# EAGLE design Sch (EAGLE 9.6.1)
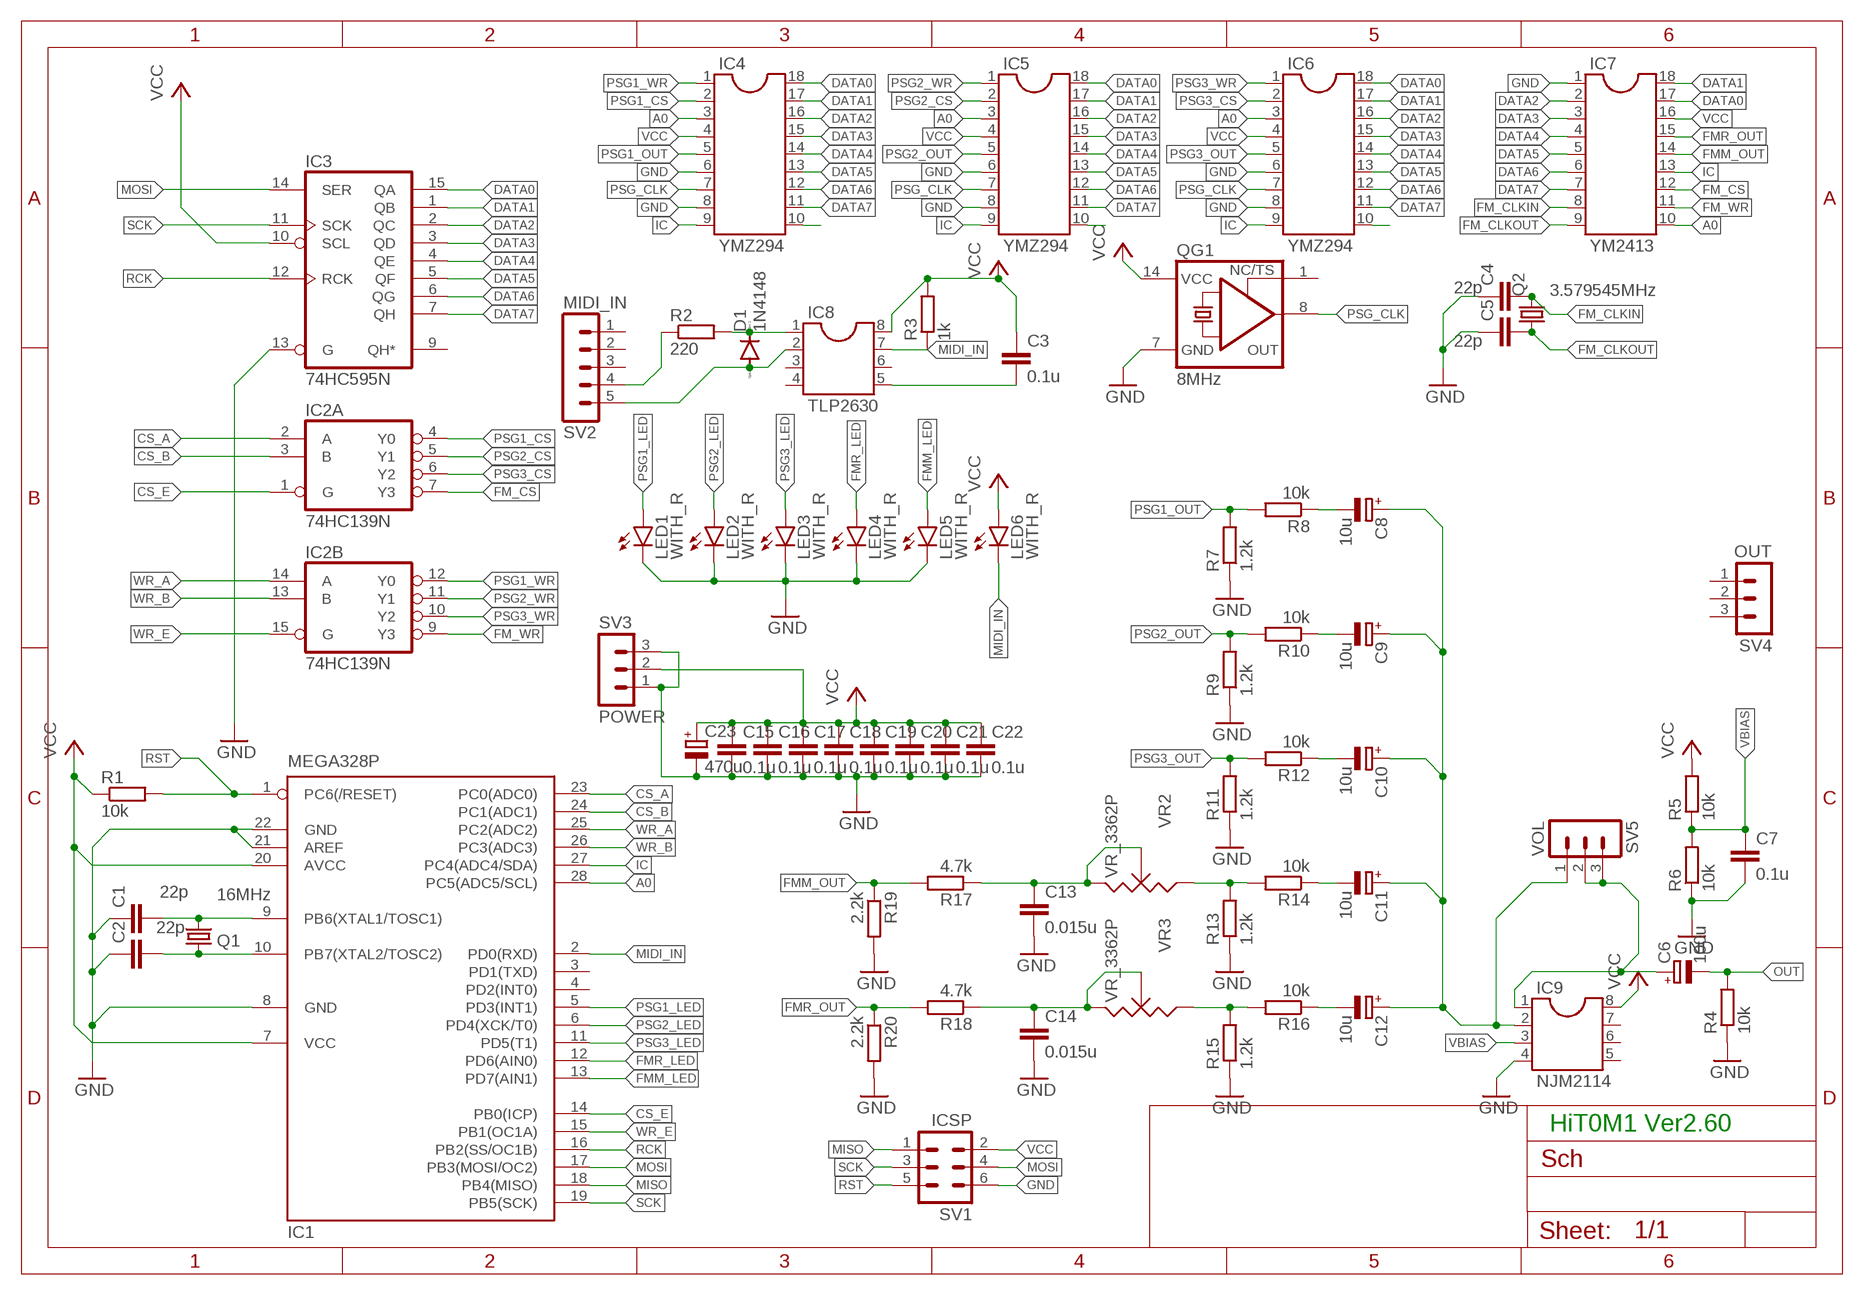
[diagram p0: schematic, sheet 1]

## Parts
C1  22p  C-EU025-025X050  [C025-025X050]
C2  22p  C-EU025-025X050  [C025-025X050]
C3  0.1u  C-EU025-025X050  [C025-025X050]
C4  22p  C-EU025-025X050  [C025-025X050]
C5  22p  C-EU025-025X050  [C025-025X050]
C6  100u  CPOL-EUE2.5-6  [E2,5-6]
C7  0.1u  C-EU025-025X050  [C025-025X050]
C8  10u  CPOL-EUE2.5-6  [E2,5-6]
C9  10u  CPOL-EUE2.5-6  [E2,5-6]
C10  10u  CPOL-EUE2.5-6  [E2,5-6]
C11  10u  CPOL-EUE2.5-6  [E2,5-6]
C12  10u  CPOL-EUE2.5-6  [E2,5-6]
C13  0.015u  C-EU050-025X075  [C050-025X075]
C14  0.015u  C-EU050-025X075  [C050-025X075]
C15  0.1u  C-EU025-025X050  [C025-025X050]
C16  0.1u  C-EU025-025X050  [C025-025X050]
C17  0.1u  C-EU025-025X050  [C025-025X050]
C18  0.1u  C-EU025-025X050  [C025-025X050]
C19  0.1u  C-EU025-025X050  [C025-025X050]
C20  0.1u  C-EU025-025X050  [C025-025X050]
C21  0.1u  C-EU025-025X050  [C025-025X050]
C22  0.1u  C-EU025-025X050  [C025-025X050]
C23  470u  CPOL-EUE2.5-6  [E2,5-6]
D1  1N4148  1N4148DO35-7  [DO35-7]
IC1  MEGA328P  MEGA8-P  [DIL28-3]
IC2  74HC139N  [DIL16]
IC3  74HC595N  [DIL16]
IC4  YMZ294  DIL18S  [SOCKET-18]
IC5  YMZ294  DIL18S  [SOCKET-18]
IC6  YMZ294  DIL18S  [SOCKET-18]
IC7  YM2413  DIL18S  [SOCKET-18]
IC8  TLP2630  DIL8S  [SOCKET-08]
IC9  NJM2114  DIL8S  [SOCKET-08]
LED1  WITH_R  LED3MM  [LED3MM]
LED2  WITH_R  LED3MM  [LED3MM]
LED3  WITH_R  LED3MM  [LED3MM]
LED4  WITH_R  LED3MM  [LED3MM]
LED5  WITH_R  LED3MM  [LED3MM]
LED6  WITH_R  LED3MM  [LED3MM]
Q1  16MHz  CRYSTALHC49S  [HC49/S]
Q2  3.579545MHz  CRYSTALHC49S  [HC49/S]
QG1  8MHz  XO-14  [DIL14S]
R1  10k  R-EU_0207/10  [0207/10]
R2  220  R-EU_0207/10  [0207/10]
R3  1k  R-EU_0207/10  [0207/10]
R4  10k  R-EU_0207/10  [0207/10]
R5  10k  R-EU_0207/10  [0207/10]
R6  10k  R-EU_0207/10  [0207/10]
R7  1.2k  R-EU_0207/2V  [0207/2V]
R8  10k  R-EU_0207/2V  [0207/2V]
R9  1.2k  R-EU_0207/2V  [0207/2V]
R10  10k  R-EU_0207/2V  [0207/2V]
R11  1.2k  R-EU_0207/2V  [0207/2V]
R12  10k  R-EU_0207/2V  [0207/2V]
R13  1.2k  R-EU_0207/2V  [0207/2V]
R14  10k  R-EU_0207/2V  [0207/2V]
R15  1.2k  R-EU_0207/2V  [0207/2V]
R16  10k  R-EU_0207/2V  [0207/2V]
R17  4.7k  R-EU_0207/2V  [0207/2V]
R18  4.7k  R-EU_0207/2V  [0207/2V]
R19  2.2k  R-EU_0207/2V  [0207/2V]
R20  2.2k  R-EU_0207/2V  [0207/2V]
SV1  ICSP  MA03-2  [MA03-2]
SV2  MIDI_IN  MA05-1  [MA05-1]
SV3  POWER  MA03-1  [MA03-1]
SV4  OUT  MA03-1  [MA03-1]
SV5  VOL  MA03-1  [MA03-1]
VR2  VR_3362P  P-03277_VR_3362P  [VR_3362P]
VR3  VR_3362P  P-03277_VR_3362P  [VR_3362P]

## Nets
A0 [SIGNAL]: IC1.28(PC5(ADC5/SCL)) IC4.3 IC5.3 IC6.3 IC7.10
CS_A [SIGNAL]: IC1.23(PC0(ADC0)) IC2.2(A:A)
CS_B [SIGNAL]: IC1.24(PC1(ADC1)) IC2.3(A:B)
CS_E: IC1.14(PB0(ICP)) IC2.1(A:G)
DATA0 [SIGNAL]: IC3.15(QA) IC4.18 IC5.18 IC6.18 IC7.17
DATA1 [SIGNAL]: IC3.1(QB) IC4.17 IC5.17 IC6.17 IC7.18
DATA2 [SIGNAL]: IC3.2(QC) IC4.16 IC5.16 IC6.16 IC7.2
DATA3 [SIGNAL]: IC3.3(QD) IC4.15 IC5.15 IC6.15 IC7.3
DATA4 [SIGNAL]: IC3.4(QE) IC4.14 IC5.14 IC6.14 IC7.4
DATA5 [SIGNAL]: IC3.5(QF) IC4.13 IC5.13 IC6.13 IC7.5
DATA6 [SIGNAL]: IC3.6(QG) IC4.12 IC5.12 IC6.12 IC7.6
DATA7 [SIGNAL]: IC3.7(QH) IC4.11 IC5.11 IC6.11 IC7.7
FM_CLKIN: C4.2 IC7.8 Q2.2
FM_CLKOUT: C5.2 IC7.9 Q2.1
FM_CS [SIGNAL]: IC2.7(A:Y3) IC7.12
FM_WR [SIGNAL]: IC2.9(B:Y3) IC7.11
FMM_LED [SIGNAL]: IC1.13(PD7(AIN1)) LED5.A
FMM_OUT: IC7.14 R17.2 R19.1
FMR_LED [SIGNAL]: IC1.12(PD6(AIN0)) LED4.A
FMR_OUT: IC7.15 R18.2 R20.1
GND [POWERLINE]: C1.1 C2.1 C4.1 C5.1 C7.2 C13.2 C14.2 C15.2 C16.2 C17.2 C18.2 C19.2 C20.2 C21.2 C22.2 C23.- IC1.8(GND) IC1.21(AREF) IC1.22(GND) IC3.13(G) IC4.6 IC4.8 IC5.6 IC5.8 IC6.6 IC6.8 IC7.1 IC9.4 LED1.K(C) LED2.K(C) LED3.K(C) LED4.K(C) LED5.K(C) QG1.7(GND) R4.1 R6.1 R7.1 R9.1 R11.1 R13.1 R15.1 R19.2 R20.2 SV1.6 SV3.1 SV3.3
IC [SIGNAL]: IC1.27(PC4(ADC4/SDA)) IC4.9 IC5.9 IC6.9 IC7.13
MIDI_IN: IC1.2(PD0(RXD)) IC8.7 LED6.K(C) R3.1
MISO [SIGNAL]: IC1.18(PB4(MISO)) SV1.1
MOSI [SIGNAL]: IC1.17(PB3(MOSI/OC2)) IC3.14(SER) SV1.4
N$1: C1.2 IC1.9(PB6(XTAL1/TOSC1)) Q1.2
N$2: R2.1 SV2.4
N$3: D1.C IC8.1 R2.2
N$4: D1.A IC8.2 SV2.5
N$5: C3.2 IC8.5
N$7: C6.+ IC9.1 SV5.2 SV5.3
N$8: IC5.10
N$10: C8.- R8.1
N$11: IC4.10
N$13: IC6.10
N$14: C2.2 IC1.10(PB7(XTAL2/TOSC2)) Q1.1
N$15: C9.- R10.1
N$17: C10.- R12.1
N$18: R13.2 R14.2 VR2.1
N$19: C11.- R14.1
N$20: R15.2 R16.2 VR3.1
N$21: C12.- R16.1
N$22: C14.1 R18.1 VR3.2 VR3.3
N$23: C8.+ C9.+ C10.+ C11.+ C12.+ IC9.2 SV5.1
N$24: C13.1 R17.1 VR2.2 VR2.3
OUT: C6.- R4.2
PSG1_CS [SIGNAL]: IC2.4(A:Y0) IC4.2
PSG1_LED [SIGNAL]: IC1.5(PD3(INT1)) LED1.A
PSG1_OUT: IC4.5 R7.2 R8.2
PSG1_WR [SIGNAL]: IC2.12(B:Y0) IC4.1
PSG2_CS [SIGNAL]: IC2.5(A:Y1) IC5.2
PSG2_LED [SIGNAL]: IC1.6(PD4(XCK/T0)) LED2.A
PSG2_OUT: IC5.5 R9.2 R10.2
PSG2_WR [SIGNAL]: IC2.11(B:Y1) IC5.1
PSG3_CS [SIGNAL]: IC2.6(A:Y2) IC6.2
PSG3_LED [SIGNAL]: IC1.11(PD5(T1)) LED3.A
PSG3_OUT: IC6.5 R11.2 R12.2
PSG3_WR [SIGNAL]: IC2.10(B:Y2) IC6.1
PSG_CLK [SIGNAL]: IC4.7 IC5.7 IC6.7 QG1.8(OUT)
RCK [SIGNAL]: IC1.16(PB2(SS/OC1B)) IC3.12(RCK)
RST [SIGNAL]: IC1.1(PC6(/RESET)) R1.2 SV1.5
SCK [SIGNAL]: IC1.19(PB5(SCK)) IC3.11(SCK) SV1.3
VBIAS [SIGNAL]: C7.1 IC9.3 R5.1 R6.2
VCC [POWERLINE]: C3.1 C15.1 C16.1 C17.1 C18.1 C19.1 C20.1 C21.1 C22.1 C23.+ IC1.7(VCC) IC1.20(AVCC) IC3.10(SCL) IC4.4 IC5.4 IC6.4 IC7.16 IC8.8 IC9.8 LED6.A QG1.14(VCC) R1.1 R3.2 R5.2 SV1.2 SV3.2
WR_A [SIGNAL]: IC1.25(PC2(ADC2)) IC2.14(B:A)
WR_B [SIGNAL]: IC1.26(PC3(ADC3)) IC2.13(B:B)
WR_E: IC1.15(PB1(OC1A)) IC2.15(B:G)
Unconnected: IC1.3(PD1(TXD)) IC1.4(PD2(INT0)) IC3.9(QH*) IC8.3 IC8.4 IC8.6 IC9.5 IC9.6 IC9.7 QG1.1(TS) SV2.1 SV2.2 SV2.3 SV4.1 SV4.2 SV4.3

## Notes on the sheet
- HiT0M1 Ver2.60

## Power pins joined to a net without a drawn wire
GND: IC2.8(P:GND) IC3.8(GND)
VCC: IC2.16(P:VCC) IC3.16(VCC)

## Library data of the parts
C1-C5 C7 C13-C22 = rcl:C-EU: CAPACITOR, European symbol; SPICEPREFIX: C
C6 C8-C12 C23 = rcl:CPOL-EU: POLARIZED CAPACITOR, European symbol; SPICEPREFIX: C
D1 = diode:1N4148: DIODE high speed (Philips)
IC1 = atmel:MEGA8-P: MICROCONTROLLER 8 Kbytes FLASH, 1 kbytes SRAM, 512 bytes EEPROM, USART, 4-channel 10 bit ADC, 2-channel 8 bit ADC Pin compatible with Atmega48, ATMega88, ATMega168 Source: avr.lbr; OC_FARNELL: unknown; OC_NEWARK: unknown
IC2 = 74xx-eu:74*139: Dual 2-line to 4-line DECODER/DEMULTIPLEXER
IC3 = 74xx-eu:74*595: 8-bit SHIFT REGISTER, output latch
IC4-IC7 = ic-package:DIL18: Dual In Line / Socket
IC8 IC9 = ic-package:DIL8: Dual In Line / Socket
LED1-LED6 = led:LED: LED OSRAM: - CHIPLED LG R971, LG N971, LY N971, LG Q971, LY Q971, LO R971, LY R971 LH N974, LH R974 LS Q976, LO Q976, LY Q976 LO Q996 - Hyper CHIPLED LW Q18S LB Q993, LB Q99A, LB R99A - SideLED LS A670, LO A670, LY A670, LG A670, LP A670 LB A673, LV A673, LT A673, LW A673 LH A674 LY A675 LS A676, LA A676, LO A676, LY A676, LW A676 LS A679, LY A679, LG A679 - Hyper Micro SIDELED® LS Y876, LA Y876, LO Y876, LY Y876 LT Y87S - SmartLED LW L88C, LW L88S LB L89C, LB L89S, LG L890 LS L89K, LO L89K, LY L89K LS L896, LA L896, LO L896, LY L896 - TOPLED LS T670, LO T670, LY T670, LG T670, LP T670 LSG T670, LSP T670, LSY T670, LOP T670, LYG T670 LG T671, LOG T671, LSG T671 LB T673, LV T673, LT T673, LW T673 LH T674 LS T676, LA T676, LO T676, LY T676, LB T676, LH T676, LSB T676, LW T676 LB T67C, LV T67C, LT T67C, LS T67K, LO T67K, LY T67K, LW E67C LS E67B, LA E67B, LO E67B, LY E67B, LB E67C, LV E67C, LT E67C LW T67C LS T679, LY T679, LG T679 LS T770, LO T770, LY T770, LG T770, LP T770 LB T773, LV T773, LT T773, LW T773 LH T774 LS E675, LA E675, LY E675, LS T675 LS T776, LA T776, LO T776, LY T776, LB T776 LHGB T686 LT T68C, LB T68C - Hyper Mini TOPLED® LB M676 - Mini TOPLED Santana® LG M470 LS M47K, LO M47K, LY M47K Source: http://www.osram.convergy.de LUXEON: - LUMILED® LXK2-PW12-R00, LXK2-PW12-S00, LXK2-PW14-U00, LXK2-PW14-V00 LXK2-PM12-R00, LXK2-PM12-S00, LXK2-PM14-U00 LXK2-PE12-Q00, LXK2-PE12-R00, LXK2-PE12-S00, LXK2-PE14-T00, LXK2-PE14-U00 LXK2-PB12-K00, LXK2-PB12-L00, LXK2-PB12-M00, LXK2-PB14-N00, LXK2-PB14-P00, LXK2-PB14-Q00 LXK2-PR12-L00, LXK2-PR12-M00, LXK2-PR14-Q00, LXK2-PR14-R00 LXK2-PD12-Q00, LXK2-PD12-R00, LXK2-PD12-S00 LXK2-PH12-R00, LXK2-PH12-S00 LXK2-PL12-P00, LXK2-PL12-Q00, LXK2-PL12-R00 Source: www.luxeon.com KINGBRIGHT: KA-3528ASYC Source: www.kingbright.com
Q1 Q2 = crystal:CRYSTAL: CRYSTAL; OC_FARNELL: 1667008; OC_NEWARK: unknown
QG1 = crystal:XO-: CRYSTAL; OC_FARNELL: unknown; OC_NEWARK: unknown
R1-R20 = rcl:R-EU_: RESISTOR, European symbol; SPICEPREFIX: R
SV1 = con-lstb:MA03-2: PIN HEADER; OC_FARNELL: unknown; OC_NEWARK: unknown
SV2 = con-lstb:MA05-1: PIN HEADER; OC_FARNELL: unknown; OC_NEWARK: unknown
SV3-SV5 = con-lstb:MA03-1: PIN HEADER; OC_FARNELL: unknown; OC_NEWARK: unknown
VR2 VR3 = Akizuki:P-03277_VR_3362P

## Net classes
0 other: width 0.635 mm, clearance 0.33 mm
1 POWERLINE: width 0.889 mm, clearance 0.33 mm
2 SIGNAL: width 0.508 mm, clearance 0.254 mm

## Board
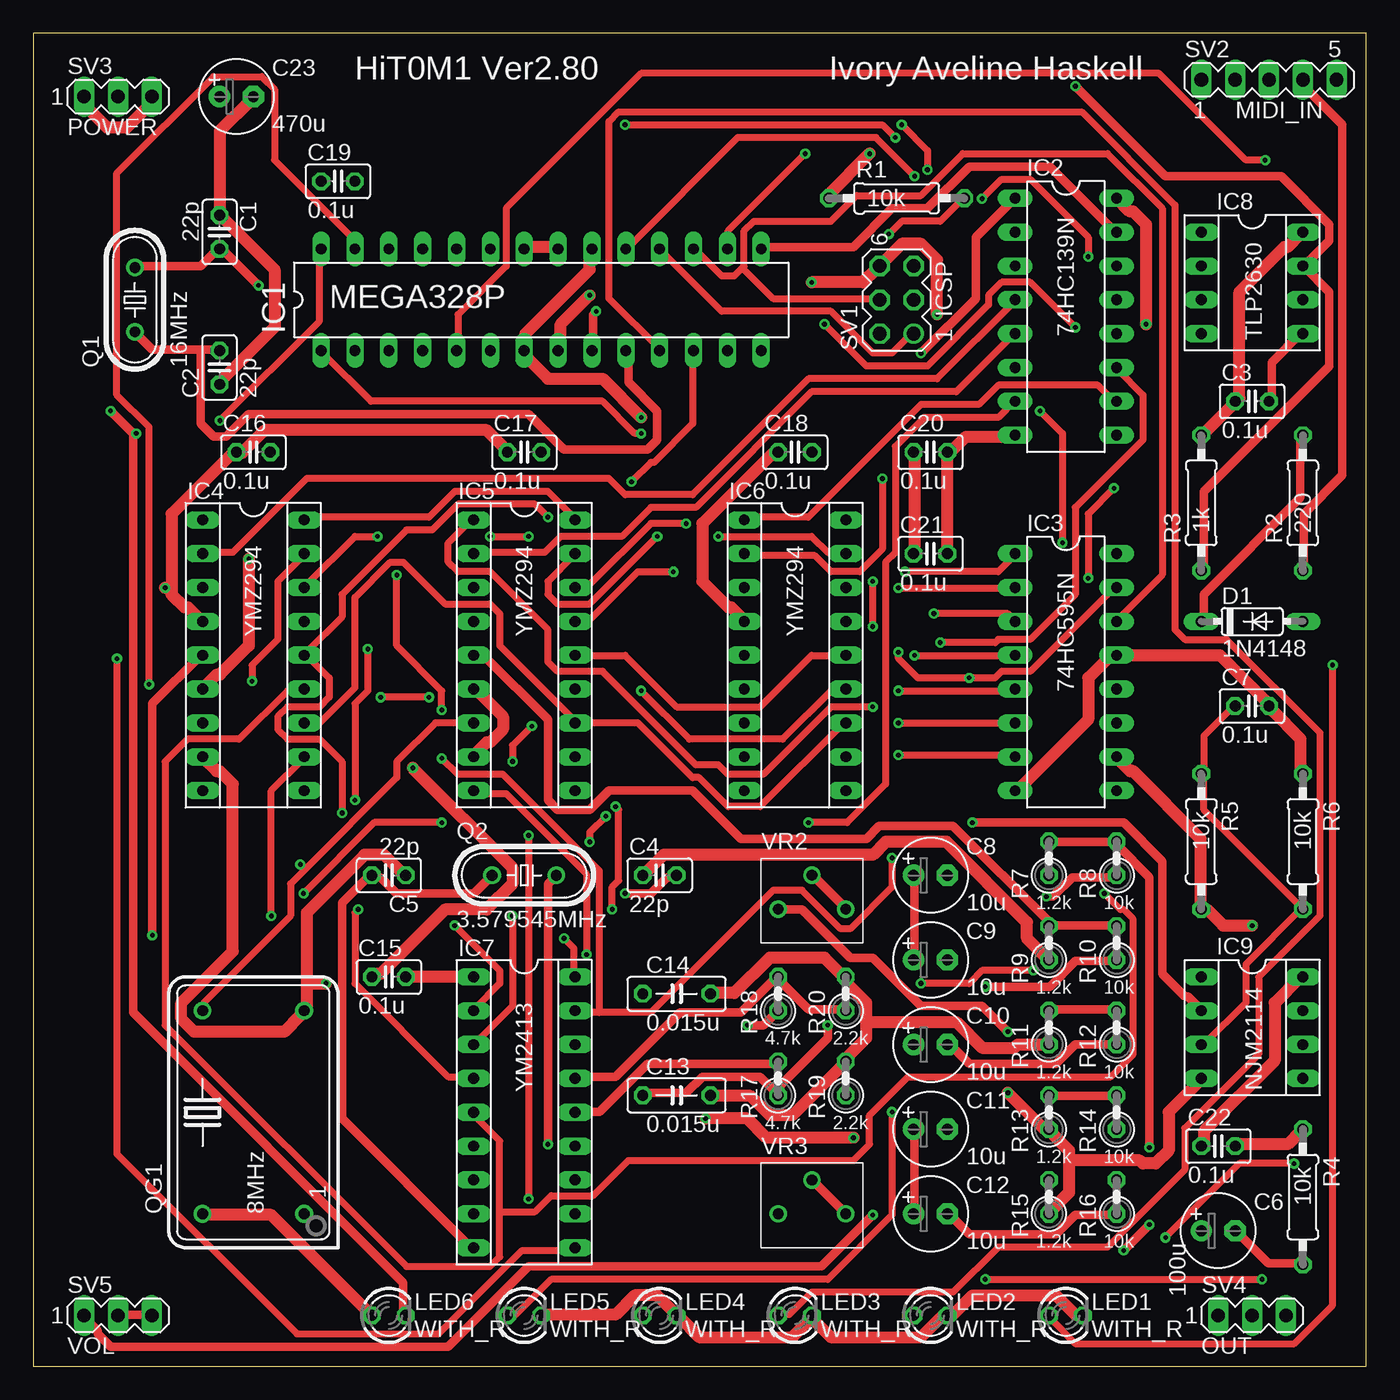
[diagram p1: board, top side]
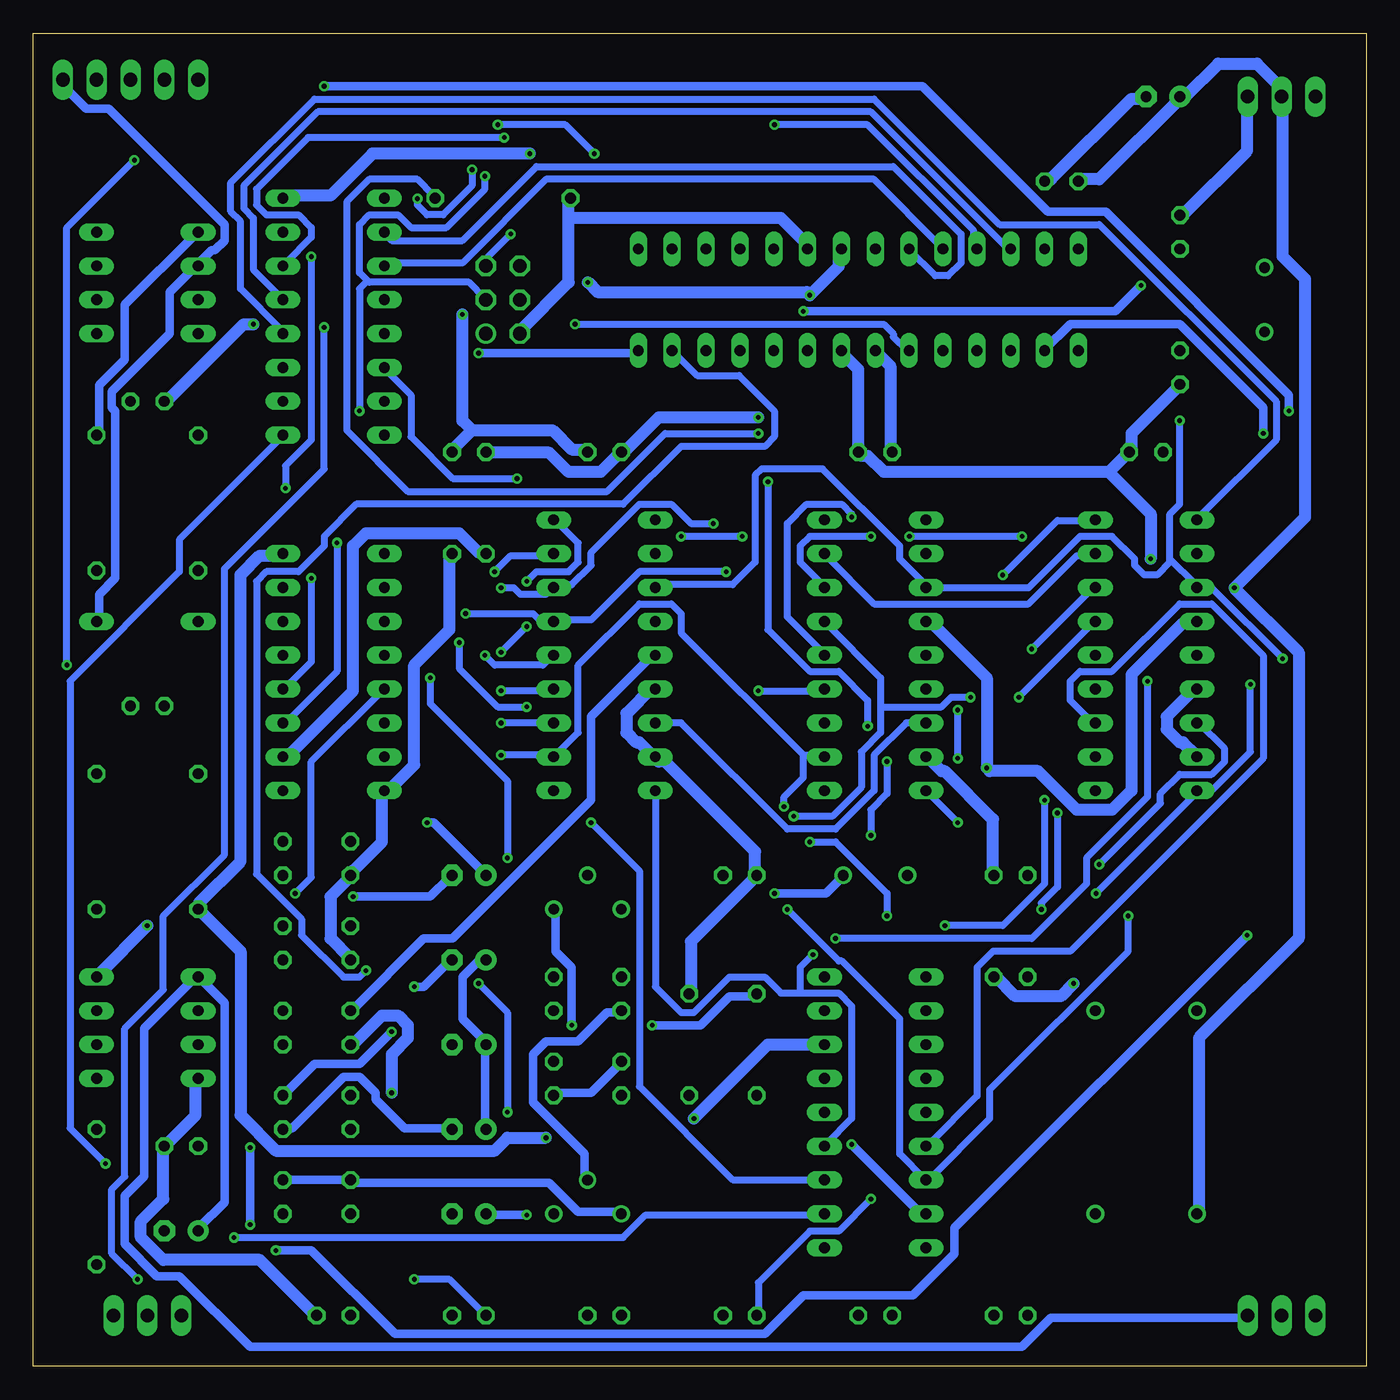
[diagram p2: board, bottom side, seen from below]

Size 100 x 100 mm. Coordinates in mm from the lower left corner, seen from the top.
Outline: 0,0 100,0 100,100 0,100 0,0
Copper layers (1*16): Top 0.035mm / dielectric 1.5mm / Bottom 0.035mm
Design rules "default": minimum track width 6mil, minimum drill 0.35mm, track to track 6mil, track to pad 6mil, pad to pad 6mil, via to via 6mil, smd to smd 6mil, copper to edge 40mil, drill to drill 6mil, minimum pad ring 10mil, minimum via ring 8mil, stop-mask expansion 4mil, vias tented up to drill 0mil, thermal gap 10mil

### Footprints (pad centres in the part's own frame; a part is rotated, then mirrored left to right if it is on the bottom)
C025-025X050 = drill 0.813 octagon: 1 -1.27,0; 2 1.27,0
E2,5-6 = drill 0.813 pad 1.6: + -1.27,0 | drill 0.813 pad 1.6 octagon: - 1.27,0
C050-025X075 = drill 0.813 octagon: 1 -2.54,0; 2 2.54,0
DO35-7 = drill 0.813 long: A 3.81,0; C -3.81,0
DIL28-3 = drill 0.813 long: 1 -16.51,-3.81; 2 -13.97,-3.81; 3 -11.43,-3.81; 4 -8.89,-3.81; 5 -6.35,-3.81; 6 -3.81,-3.81; 7 -1.27,-3.81; 8 1.27,-3.81; 9 3.81,-3.81; 10 6.35,-3.81; 11 8.89,-3.81; 12 11.43,-3.81; 13 13.97,-3.81; 14 16.51,-3.81; 15 16.51,3.81; 16 13.97,3.81; 17 11.43,3.81; 18 8.89,3.81; 19 6.35,3.81; 20 3.81,3.81; 21 1.27,3.81; 22 -1.27,3.81; 23 -3.81,3.81; 24 -6.35,3.81; 25 -8.89,3.81; 26 -11.43,3.81; 27 -13.97,3.81; 28 -16.51,3.81
DIL16 = drill 0.813 long: 1 -8.89,-3.81; 2 -6.35,-3.81; 3 -3.81,-3.81; 4 -1.27,-3.81; 5 1.27,-3.81; 6 3.81,-3.81; 7 6.35,-3.81; 8 8.89,-3.81; 9 8.89,3.81; 10 6.35,3.81; 11 3.81,3.81; 12 1.27,3.81; 13 -1.27,3.81; 14 -3.81,3.81; 15 -6.35,3.81; 16 -8.89,3.81
SOCKET-18 = drill 0.813 long: 1 -10.16,-3.81; 2 -7.62,-3.81; 3 -5.08,-3.81; 4 -2.54,-3.81; 5 0,-3.81; 6 2.54,-3.81; 7 5.08,-3.81; 8 7.62,-3.81; 9 10.16,-3.81; 10 10.16,3.81; 11 7.62,3.81; 12 5.08,3.81; 13 2.54,3.81; 14 0,3.81; 15 -2.54,3.81; 16 -5.08,3.81; 17 -7.62,3.81; 18 -10.16,3.81
SOCKET-08 = drill 0.813 long: 1 -3.81,-3.81; 2 -1.27,-3.81; 3 1.27,-3.81; 4 3.81,-3.81; 5 3.81,3.81; 6 1.27,3.81; 7 -1.27,3.81; 8 -3.81,3.81
LED3MM = drill 0.813 octagon: A -1.27,0; K 1.27,0
HC49/S = drill 0.813: 1 -2.413,0; 2 2.413,0
DIL14S = drill 0.813: 1 -7.62,-3.81; 7 7.62,-3.81; 8 7.62,3.81; 14 -7.62,3.81
0207/10 = drill 0.813 octagon: 1 -5.08,0; 2 5.08,0
0207/2V = drill 0.813 octagon: 1 -1.27,0; 2 1.27,0
MA03-2 = drill 1.016: 1 -2.54,-1.27 | drill 1.016 octagon: 2 -2.54,1.27; 3 0,-1.27; 4 0,1.27; 5 2.54,-1.27; 6 2.54,1.27
MA05-1 = drill 1.016 long: 1 -5.08,0; 2 -2.54,0; 3 0,0; 4 2.54,0; 5 5.08,0
MA03-1 = drill 1.016 long: 1 -2.54,0; 2 0,0; 3 2.54,0
VR_3362P = drill 0.8: 1 0,0; 2 2.54,2.54; 3 5.08,0

### Placement (x,y rotation side)
C1  13.97,85.09 270 top
C2  13.97,74.93 90 top
C3  91.44,72.39 0 top
C4  46.99,36.83 0 top
C5  26.67,36.83 180 top
C6  88.9,10.16 0 top
C7  91.44,49.53 0 top
C8  67.31,36.83 0 top
C9  67.31,30.48 0 top
C10  67.31,24.13 0 top
C11  67.31,17.78 0 top
C12  67.31,11.43 0 top
C13  48.26,20.32 0 top
C14  48.26,27.94 0 top
C15  26.67,29.21 0 top
C16  16.51,68.58 0 top
C17  36.83,68.58 0 top
C18  57.15,68.58 0 top
C19  22.86,88.9 0 top
C20  67.31,68.58 0 top
C21  67.31,60.96 0 top
C22  88.9,16.51 0 top
C23  15.24,95.25 0 top
D1  91.44,55.88 0 top
IC1  38.1,80.01 0 top
IC2  77.47,78.74 270 top
IC3  77.47,52.07 270 top
IC4  16.51,53.34 270 top
IC5  36.83,53.34 270 top
IC6  57.15,53.34 270 top
IC7  36.83,19.05 270 top
IC8  91.44,81.28 270 top
IC9  91.44,25.4 270 top
LED1  77.47,3.81 0 top
LED2  67.31,3.81 0 top
LED3  57.15,3.81 0 top
LED4  46.99,3.81 0 top
LED5  36.83,3.81 0 top
LED6  26.67,3.81 0 top
Q1  7.62,80.01 90 top
Q2  36.83,36.83 0 top
QG1  16.51,19.05 90 top
R1  64.77,87.63 0 top
R2  95.25,64.77 90 top
R3  87.63,64.77 90 top
R4  95.25,12.7 270 top
R5  87.63,39.37 270 top
R6  95.25,39.37 270 top
R7  76.2,38.1 90 top
R8  81.28,38.1 90 top
R9  76.2,31.75 90 top
R10  81.28,31.75 90 top
R11  76.2,25.4 90 top
R12  81.28,25.4 90 top
R13  76.2,19.05 90 top
R14  81.28,19.05 90 top
R15  76.2,12.7 90 top
R16  81.28,12.7 90 top
R17  55.88,21.59 90 top
R18  55.88,27.94 90 top
R19  60.96,21.59 90 top
R20  60.96,27.94 90 top
SV1  64.77,80.01 90 top
SV2  92.71,96.52 0 top
SV3  6.35,95.25 0 top
SV4  91.44,3.81 0 top
SV5  6.35,3.81 0 top
VR2  55.88,34.29 0 top
VR3  55.88,11.43 0 top

### Tracks (layer width: path | path; a pad name or v marks a point on that pad's centre or on a via)
A0  (via drill 0.35)
  Top 0.508: v6.27,53.09 6.27,15.93 19.79,2.41 30.4,2.41 36.68,8.69 40.54,8.69 IC7.10 | v13.99,70.94 21.48,78.42 21.48,83.73 IC1.28
  Bottom 0.508: v6.27,53.09 11.58,58.4 12.55,58.4 IC4.3 12.79,58.64 14.72,60.57 | v13.99,70.94 13.99,64.67 14.72,63.94 14.72,60.57 | 14.72,60.57 14.72,60.33 15.68,59.36 16.65,59.36 17.37,60.08 17.37,60.57 19.06,62.26 21.48,62.26 25.34,58.4 32.82,58.4 IC5.3 33.06,58.64 34.99,60.57 34.99,61.53 40.78,67.32 45.36,67.32 45.85,66.84 45.85,60.33 47.54,58.64 53.33,58.64 IC6.3
CS_A
  Bottom 0.508: IC1.23 34.27,83.73 32.33,81.8 31.37,81.8 30.4,82.77 30.4,84.94 35.47,90 62.26,90 67.81,84.45 73.11,84.45 73.6,84.94 IC2.2
CS_B
  Bottom 0.508: IC2.3 73.6,82.77 67.81,82.77 61.53,89.04 36.92,89.04 31.85,83.97 IC1.24
CS_E  (via drill 0.35)
  Top 0.635: v66.6,76.01 70.7,80.11 70.7,84.7 73.6,87.59 IC2.1
  Bottom 0.635: v66.6,76.01 54.77,76.01 IC1.14
DATA0  (via drill 0.35)
  Top 0.508: IC4.18 20.51,63.7 29.68,63.7 31.61,65.63 38.61,65.63 40.54,63.7 IC5.18 | 42.47,26.54 46.33,26.54 55.5,35.71 57.67,35.71 60.57,32.82 61.29,32.82 64.43,35.95 v64.43,38.12 | 42.47,26.54 40.78,26.54 IC7.17 | IC3.15 81.08,58.4 74.8,52.12 72.63,52.12 72.15,51.64 v70.22,51.64 66.36,51.64 64.91,53.09 v64.91,53.57 | v62.98,55.5 v62.98,58.88 | v27.27,59.36 27.27,54.05 30.64,50.67 v30.64,49.23 | v30.64,45.61 31.85,44.4 35.23,44.4 42.47,37.16 42.47,26.54
  Bottom 0.508: v64.43,38.12 64.43,43.92 70.22,49.71 v70.22,51.64 | v62.98,58.88 62.26,59.6 59.84,59.6 59.12,60.33 59.12,61.77 60.81,63.46 IC6.18 | v64.91,53.57 v62.98,55.5 | v27.27,59.36 23.16,63.46 20.51,63.46 IC4.18 | v30.64,45.61 v30.64,49.23
DATA1  (via drill 0.35)
  Top 0.508: v65.39,59.6 72.39,59.6 73.6,60.81 IC3.1 | v39.81,32.09 40.54,31.37 40.54,29.44 IC7.18 | v16.41,51.4 16.41,52.6 18.34,54.53 18.34,58.88 20.27,60.81 IC4.17 | v51.4,62.26 58.4,62.26 59.6,61.05 60.81,61.05 IC6.17 | v46.81,62.26 41.74,57.19 39.33,57.19 38.61,57.91 38.61,58.88 40.54,60.81 IC5.17
  Bottom 0.508: v65.39,59.6 64.19,60.81 61.05,60.81 IC6.17 | IC4.17 20.51,60.81 21.72,60.81 25.34,57.19 36.92,57.19 40.54,60.81 IC5.17 | v39.81,32.09 25.09,32.09 20.99,36.2 20.99,38.12 16.41,42.71 v16.41,51.4 | v46.81,62.26 v51.4,62.26
DATA2  (via drill 0.35)
  Top 0.508: v48.98,63.22 46.33,63.22 41.74,58.64 40.78,58.64 IC5.16 | v64.91,58.4 73.6,58.4 IC3.2 | v31.61,33.06 34.99,29.68 34.99,28.71 33.06,26.78 IC7.2 | v24.13,42.47 24.13,49.71 25.09,50.67 v25.09,53.81 | v34.27,62.26 v37.16,62.26 | v25.82,62.26 24.13,62.26 20.51,58.64 IC4.16
  Bottom 0.508: v48.98,63.22 50.67,63.22 52.12,64.67 54.53,64.67 58.15,61.05 58.15,60.08 59.6,58.64 60.81,58.64 IC6.16 61.05,58.4 61.53,57.91 63.46,57.91 63.94,58.4 v64.91,58.4 | v31.61,33.06 27.27,33.06 24.13,36.2 v24.13,42.47 | v25.09,53.81 20.51,58.4 IC4.16 | v37.16,62.26 41.74,62.26 42.47,61.53 42.47,60.33 40.78,58.64 IC5.16 | v25.82,62.26 v34.27,62.26
DATA3  (via drill 0.35)
  Top 0.508: v67.56,56.46 73.11,56.46 73.6,55.98 IC3.3 | v35.95,33.78 35.95,27.03 33.06,24.13 IC7.3 | v41.74,39.33 41.74,40.06 v42.95,41.26 | v29.68,50.19 v26.06,50.19 | v48.02,59.6 45.36,59.6 41.74,55.98 40.78,55.98 IC5.15
  Bottom 0.508: v67.56,56.46 62.5,56.46 62.01,55.98 61.05,55.98 IC6.15 60.81,55.98 58.15,55.98 54.53,59.6 v48.02,59.6 | v35.95,33.78 35.95,35.47 39.81,39.33 v41.74,39.33 | v42.95,41.26 40.06,41.26 37.88,43.43 37.88,46.09 36.44,47.54 36.44,49.47 | 36.44,49.47 36.44,51.64 40.54,55.74 IC5.15 | v26.06,50.19 20.51,55.74 IC4.15 | v29.68,50.19 31.13,50.19 31.85,49.47 36.44,49.47
DATA4  (via drill 0.35)
  Top 0.508: v38.61,63.7 37.64,64.67 31.85,64.67 29.92,62.74 27.99,62.74 23.16,57.91 23.16,56.22 20.51,53.57 IC4.14 20.51,53.33 22.2,51.64 22.2,50.19 21.48,49.47 19.06,49.47 18.34,48.74 18.34,47.78 19.06,47.05 21.48,47.05 23.16,45.36 v23.16,41.5 | v24.37,34.27 24.13,34.02 24.13,28.71 31.13,21.72 32.82,21.72 IC7.4 | IC6.14 60.81,53.33 58.4,53.33 54.53,49.47 48.26,49.47 44.4,53.33 40.78,53.33 IC5.14 | v66.12,53.33 73.6,53.33 IC3.4
  Bottom 0.508: v38.61,63.7 38.61,63.94 39.33,64.67 41.99,64.67 43.43,63.22 43.43,56.22 40.78,53.57 IC5.14 | v24.37,34.27 24.37,34.75 23.16,35.95 v23.16,41.5 | v66.12,53.33 65.39,52.6 61.77,52.6 61.05,53.33 IC6.14
DATA5  (via drill 0.35)
  Top 0.508: v45.61,50.67 49.23,47.05 56.22,47.05 59.84,50.67 60.81,50.67 IC6.13 | v64.91,50.67 73.6,50.67 IC3.5 | 34.99,11.58 34.99,8.2 34.27,7.48 27.99,7.48 9.89,25.58 9.89,45.36 11.58,47.05 15.44,47.05 19.06,50.67 20.27,50.67 IC4.13 | 34.99,11.58 34.99,16.89 33.06,18.82 IC7.5 | v80.35,35.47 81.56,34.27 81.8,34.27 82.53,33.54 82.53,23.41 80.83,21.72 65.63,21.72 62.74,18.82 62.74,16.65 61.53,15.44 44.64,15.44 41.99,12.79 38.85,12.79 37.64,11.58 34.99,11.58
  Bottom 0.508: v45.61,50.67 40.78,50.67 IC5.13 | v64.91,50.67 61.05,50.67 IC6.13 | v80.35,35.47 79.15,36.68 79.15,45.36 73.84,50.67 IC3.5
DATA6  (via drill 0.35)
  Top 0.508: IC6.12 60.81,48.26 54.53,41.99 52.12,41.99 49.95,44.16 49.47,44.16 45.36,48.26 IC5.12 40.54,48.5 34.99,54.05 34.99,56.46 34.27,57.19 30.89,57.19 27.75,60.33 26.78,60.33 24.13,57.67 24.13,50.91 21.48,48.26 IC4.12 | v64.91,48.26 IC3.6
  Bottom 0.508: IC6.12 v64.91,48.26 | IC7.6 32.82,16.65 29.2,20.27 29.2,29.92 27.99,31.13 22.2,31.13 7.72,45.61 7.72,53.33 11.58,57.19 13.99,57.19 19.06,52.12 21.48,52.12 22.2,51.4 22.2,49.95 20.51,48.26 IC4.12
DATA7  (via drill 0.35)
  Top 0.508: v64.91,45.85 73.6,45.85 IC3.7 | v17.86,33.78 17.86,43.19 20.27,45.61 IC4.11 | v43.67,41.99 43.92,41.74 43.92,36.44 43.43,35.95 v43.43,34.27
  Bottom 0.508: 42.23,45.85 40.78,45.85 IC5.11 | 42.23,45.85 51.4,55.02 51.4,56.46 52.12,57.19 54.53,57.19 59.12,52.6 59.12,47.54 60.81,45.85 IC6.11 61.05,45.85 v64.91,45.85 | v17.86,33.78 17.86,31.13 28.23,20.75 28.23,18.58 32.82,13.99 IC7.7 33.06,13.99 34.99,15.93 34.99,26.06 39.33,30.4 39.57,30.4 v43.43,34.27 | 42.23,45.85 42.23,44.16 43.67,42.71 v43.67,41.99
FM_CLKIN  (via drill 0.35)
  Top 0.635: v38.61,16.65 38.61,36.2 Q2.2 | v44.4,35.47 46.33,35.47 47.54,36.68 48.26,36.68 C4.2
  Bottom 0.635: v38.61,16.65 33.54,11.58 33.06,11.58 IC7.8 | v44.4,35.47 40.54,35.47 39.33,36.68 Q2.2
FM_CLKOUT
  Top 0.635: Q2.1 33.06,35.47 27.27,35.47 26.06,36.68 25.58,36.68 C5.2 25.09,36.68 23.16,34.75 23.16,18.58 32.82,8.93 IC7.9
FM_CS  (via drill 0.35)
  Top 0.508: v58.15,40.78 61.05,40.78 63.94,43.67 63.94,60.33 64.67,61.05 64.67,69.01 66.84,71.18 72.39,71.18 73.6,72.39 IC2.7
  Bottom 0.508: v58.15,40.78 54.53,37.16 54.53,20.99 47.54,13.99 40.78,13.99 IC7.12
FM_WR  (via drill 0.35)
  Top 0.508: v84.94,9.65 90.49,15.2 v94.59,15.2
  Bottom 0.508: v84.94,9.65 55.74,9.65 54.05,11.34 40.78,11.34 IC7.11 | v94.59,15.2 97.24,17.86 97.24,51.4 89.04,59.6 89.04,62.01 81.32,69.74 IC2.9
FMM_LED  (via drill 0.35)
  Top 0.508: v64.43,19.06 64.43,11.34 59.6,6.51 38.85,6.51 36.2,3.86 35.71,3.86 LED5.A | v66.6,28.71 70.22,28.71 71.18,29.68 v75.04,29.68
  Bottom 0.508: v64.43,19.06 64.43,26.54 v66.6,28.71 | v75.04,29.68 75.53,29.2 76.73,29.2 79.87,32.33 79.87,33.54 83.25,36.92 83.25,58.88 82.53,59.6 80.11,59.6 78.18,61.53 78.18,62.26 75.77,64.67 55.74,64.67 51.4,69.01 45.12,69.01 44.4,69.74 44.4,71.67 47.05,74.32 50.19,74.32 IC1.13
FMM_OUT
  Top 0.635: IC7.14 40.78,19.06 42.47,19.06 46.09,22.68 55.74,22.68 R17.2
  Bottom 0.635: R19.1 60.81,20.51 58.15,20.51 55.98,22.68 R17.2
FMR_LED  (via drill 0.35)
  Top 0.508: v37.16,39.81 v37.16,12.55 | v35.95,45.36 35.95,46.57 v37.4,48.02 | v44.88,66.36 46.33,67.81 46.57,67.81 49.47,70.7 49.47,76.01 IC1.12
  Bottom 0.508: v37.16,12.55 39.57,10.13 41.74,10.13 45.61,6.27 45.61,3.86 LED4.A | v37.16,39.81 37.16,41.74 35.95,42.95 v35.95,45.36 | v37.4,48.02 37.4,49.95 39.57,52.12 41.74,52.12 44.88,55.26 v44.88,66.36
FMR_OUT
  Top 0.635: IC7.15 40.78,21.72 43.67,21.72 48.5,26.54 53.09,26.54 55.74,29.2 R18.2 55.98,28.96 58.15,26.78 60.81,26.78 R20.1
GND  (via drill 0.35)
  Top 0.889: IC5.8 33.06,45.85 34.02,46.81 34.27,46.81 35.23,47.78 35.23,48.74 33.06,50.91 IC5.6 | C15.2 27.99,29.2 32.82,29.2 IC7.1 | 20.51,28.71 20.51,34.02 24.85,38.37 26.3,38.37 27.75,36.92 C5.1 | 20.51,28.71 20.51,26.78 QG1.7 20.03,26.3 18.82,25.09 12.06,25.09 11.1,26.06 11.1,27.27 14.96,31.13 14.96,43.67 13.99,44.64 13.75,44.64 12.79,45.61 IC4.8 | 20.51,28.71 v21.96,28.71 | IC1.22 36.92,83.97 39.33,83.97 IC1.21 | v41.74,80.35 39.57,78.18 39.57,76.25 IC1.8 | SV3.1 3.86,95.07 3.86,94.59 5.55,92.9 7,92.9 8.69,94.59 8.69,95.07 SV3.3 | C23.- 16.41,95.07 13.99,92.66 13.99,86.39 C1.1 14.24,86.14 18.1,82.28 18.1,77.94 13.99,73.84 C2.1 | v16.17,60.57 16.17,54.05 13.99,51.88 13.75,51.88 12.79,50.91 IC4.6 | 77.7,15.44 77.7,16.17 76.25,17.61 R13.1 75.77,17.86 v73.11,20.51 | 77.7,15.44 77.7,13.03 76.25,11.58 R15.1 | C22.2 90.25,16.65 94.11,16.65 95.07,17.61 R4.1 | 77.7,15.44 83.01,15.44 83.25,15.2 84.21,15.2 85.18,16.17 85.18,19.06 87.59,21.48 IC9.4 | LED5.K 38.12,3.86 43.67,3.86 45.12,5.31 46.81,5.31 48.26,3.86 LED4.K 48.5,3.62 49.95,2.17 56.95,2.17 58.4,3.62 LED3.K 58.64,3.38 59.84,2.17 66.6,2.17 68.05,3.62 68.53,3.62 LED2.K 69.01,3.86 70.46,5.31 76.73,5.31 78.18,3.86 78.66,3.86 LED1.K | C13.2 50.91,20.27 53.81,20.27 55.26,18.82 56.95,18.82 60.81,22.68 R19.2 61.05,23.16 62.5,24.61 62.5,25.82 | 62.5,25.82 62.5,27.27 61.05,28.71 61.05,29.2 R20.2 60.57,29.44 59.36,30.64 55.26,30.64 52.6,27.99 50.91,27.99 C14.2 | R11.1 73.84,24.13 73.6,23.89 71.18,23.89 69.25,25.82 62.5,25.82 | C21.2 68.53,61.05 68.53,68.53 C20.2 69.01,68.77 69.98,69.74 73.6,69.74 IC2.8
  Top 0.889: v67.81,78.91 67.81,83.01 66.6,84.21 65.15,84.21 63.7,82.77 SV1.6 63.22,82.28 62.26,81.32 v58.4,81.32 | R6.1 95.07,44.64 95.07,47.05 92.9,49.23 C7.2 92.66,49.71 89.04,53.33 81.32,53.33 IC3.13 80.83,53.33 79.15,51.64 79.15,48.5 73.84,43.19 IC3.8 | C4.1 45.85,36.92 47.3,38.37 62.98,38.37 63.94,39.33 68.53,39.33 74.56,33.3 74.56,32.09 76.01,30.64 R9.1
  Bottom 0.889: IC4.8 12.79,45.85 13.75,46.81 13.99,46.81 14.96,47.78 14.96,48.74 12.79,50.91 IC4.6 | v21.96,28.71 22.92,27.75 26.3,27.75 27.75,29.2 C15.2 | IC5.8 32.82,45.61 31.85,44.64 31.61,44.64 27.99,41.02 27.99,36.92 C5.1 | IC1.8 39.33,76.01 38.12,74.8 38.12,68.77 C17.2 37.88,68.29 37.4,68.29 36.2,67.08 19.3,67.08 | IC1.21 39.57,83.73 39.57,82.53 v41.74,80.35 41.99,80.59 57.67,80.59 v58.4,81.32 | C2.1 13.99,73.6 17.61,69.98 17.61,68.77 C16.2 18.1,68.29 19.3,67.08 | C19.2 24.13,89.04 23.65,89.04 17.61,95.07 16.65,95.07 C23.- | SV3.3 8.93,95.07 8.93,91.21 13.75,86.39 C1.1 | v16.17,60.57 16.17,63.94 19.3,67.08 | IC9.4 87.83,21.48 87.83,18.82 90,16.65 C22.2 90.25,16.17 90.25,12.55 91.94,10.86 91.94,9.65 90.25,7.96 83.01,7.96 78.91,3.86 LED1.K | IC6.6 53.57,50.91 55.5,48.98 55.5,47.54 54.77,46.81 54.53,46.81 53.57,45.85 IC6.8 53.09,45.36 52.6,45.36 45.85,38.61 45.85,37.16 C4.1 45.85,36.68 50.67,31.85 50.67,27.99 C14.2 | 67.08,70.22 61.05,70.22 59.6,68.77 58.64,68.77 C18.2 | 67.08,70.22 68.53,68.77 C20.2 | v67.81,78.91 67.81,70.94 67.08,70.22 | R9.1 76.25,30.64 77.7,32.09 77.7,35.23 76.25,36.68 R7.1 76.01,37.16 73.84,39.33 73.84,42.95 IC3.8 73.36,43.19 71.42,45.12 71.42,52.6 68.77,55.26 68.77,60.81 C21.2 | v73.11,20.51 73.11,23.41 71.91,24.61 71.91,25.58 72.63,26.3 73.84,26.3 76.01,24.13 R11.1
IC  (via drill 0.35)
  Top 0.508: v20.27,35.47 25.58,40.78 v30.64,40.78 | IC1.27 24.13,84.45 18.1,90.49 18.1,95.8 17.13,96.76 13.51,96.76 6.27,89.52 6.27,72.87 8.69,70.46 v8.69,51.16 | v41.5,30.89 41.5,36.92 35.47,42.95 33.06,42.95 IC5.9
  Bottom 0.508: 42.47,27.99 43.92,27.99 45.12,29.2 47.78,29.2 50.43,26.54 51.4,26.54 53.33,28.47 53.33,42.95 IC6.9 | 42.47,27.99 39.57,27.99 38.61,27.03 38.61,18.58 40.54,16.65 IC7.13 | v20.27,35.47 12.79,42.95 IC4.9 12.55,43.19 11.58,43.19 8.69,46.09 v8.69,51.16 | v30.64,40.78 32.82,42.95 IC5.9 | 42.47,27.99 42.47,29.92 v41.5,30.89
MIDI_IN  (via drill 0.35)
  Top 0.635: R3.1 87.83,59.84 87.83,65.63 97.24,75.04 97.24,80.59 95.31,82.53 IC8.7 95.56,82.77 97.24,84.45 97.24,85.66 93.62,89.28 84.94,89.28 v78.18,96.04 | LED6.K 27.75,3.86 27.75,6.27 7.48,26.54 7.48,69.74 v7.72,69.98 7.48,69.98 v5.79,71.67
  Bottom 0.635: v7.72,69.98 7.72,71.91 13.99,78.18 22.2,78.18 24.13,76.25 IC1.2 | v78.18,96.04 33.3,96.04 23.89,86.63 19.55,86.63 5.79,72.87 v5.79,71.67
MISO
  Top 0.508: IC1.18 47.05,83.73 51.64,79.15 59.84,79.15 62.98,76.01 64.43,76.01 65.88,77.46 SV1.1
MOSI
  Top 0.508: 53.33,82.53 53.33,85.18 54.05,85.9 59.84,85.9 61.77,87.83 66.6,87.83 69.74,90.97 80.59,90.97 84.7,86.87 84.7,59.36 81.32,55.98 IC3.14 | 53.33,82.53 52.6,81.8 51.64,81.8 49.71,83.73 IC1.17 | SV1.4 63.46,80.11 55.5,80.11 53.33,82.28 53.33,82.53
N$1  (via drill 0.35)
  Top 0.635: Q1.2 7.72,82.53 12.55,82.53 13.75,83.73 C1.2 14.24,83.73 v16.89,81.08 | v42.23,79.15 41.99,78.91 41.99,76.25 IC1.9
  Bottom 0.635: v42.23,79.15 18.82,79.15 v16.89,81.08
N$2
  Top 0.635: R2.1 95.31,59.84 95.31,63.94 98.21,66.84 98.21,93.14 95.31,96.04 95.31,96.52 SV2.4
N$3
  Top 0.635: D1.C 87.83,55.98 87.83,57.91 95.07,65.15 95.07,69.74 R2.2
  Bottom 0.635: IC8.1 87.83,84.94 93.14,79.63 93.14,75.53 95.07,73.6 95.07,69.98 R2.2
N$4
  Bottom 0.635: SV2.5 97.73,96.52 97.73,96.04 96.04,94.35 94.35,94.35 85.66,85.66 85.66,84.45 86.39,83.73 86.63,83.73 87.59,82.77 IC8.2 87.83,82.53 89.76,80.59 89.76,77.46 94.11,73.11 94.11,71.91 93.87,71.67 93.87,59.12 95.07,57.91 95.07,55.98 D1.A
N$5
  Top 0.635: C3.2 92.9,72.39 92.9,75.29 95.07,77.46 IC8.5
N$7
  Top 0.635: SV5.2 6.51,3.86 8.69,3.86 SV5.3
  Bottom 0.635: C6.+ 87.59,10.38 85.66,12.31 85.66,27.27 87.59,29.2 IC9.1 87.83,29.2 91.69,25.34 91.69,14.24 93.14,12.79 93.14,9.17 90.73,6.76 89.04,6.76 83.73,1.45 25.82,1.45 23.65,3.62 8.93,3.62 SV5.3
N$10  (via drill 0.35)
  Top 0.635: v76.01,35.23 76.49,35.23 77.94,36.68 81.08,36.68 R8.1
  Bottom 0.635: v76.01,35.23 70.22,35.23 68.77,36.68 C8.-
N$14
  Top 0.635: 12.55,76.25 8.93,76.25 7.72,77.46 Q1.1 | 12.55,76.25 13.75,76.25 C2.2 | 12.55,76.25 12.55,70.7 13.51,69.74 14.48,69.74 16.17,71.42 37.16,71.42 39.81,68.77 46.09,68.77 46.81,69.49 46.81,71.67 44.64,73.84 44.64,76.01 IC1.10
N$15  (via drill 0.35)
  Top 0.635: v71.42,28.47 76.25,28.47 78.18,30.4 81.08,30.4 R10.1
  Bottom 0.635: v71.42,28.47 70.7,28.47 68.77,30.4 C9.-
N$17
  Top 0.635: R12.1 78.18,24.13 76.73,22.68 70.22,22.68 68.77,24.13 C10.-
N$18  (via drill 0.35)
  Top 0.635: v73.11,25.09 71.18,27.03 66.6,27.03 62.98,30.64 61.29,30.64 57.67,34.27 55.98,34.27 VR2.1 | R13.2 76.25,20.27 81.08,20.27 R14.2
  Bottom 0.635: v73.11,25.09 75.53,22.68 78.91,22.68 81.08,20.51 R14.2
N$19
  Bottom 0.635: R14.1 81.08,17.86 80.59,17.86 76.73,21.72 75.53,21.72 74.32,20.51 74.32,20.03 72.15,17.86 68.77,17.86 C11.-
N$20
  Bottom 0.635: VR3.1 55.98,11.58 59.12,11.58 61.29,13.75 76.01,13.75 R15.2 76.49,13.99 81.08,13.99 R16.2
N$21
  Top 0.635: R16.1 81.08,11.34 78.18,11.34 76.73,9.89 70.22,9.89 68.77,11.34 C12.-
N$22  (via drill 0.35)
  Top 0.635: VR3.2 VR3.3 | v53.57,25.58 54.77,25.58 55.74,26.54 R18.1
  Bottom 0.635: R18.1 55.98,26.54 56.95,26.54 59.12,24.37 61.53,24.37 62.5,23.41 62.5,19.79 58.64,15.93 58.64,13.99 VR3.2 | v53.57,25.58 49.95,25.58 47.78,27.75 45.85,27.75 C14.1
N$23  (via drill 0.35)
  Top 0.635: v70.46,40.78 81.8,40.78 84.7,37.88 84.7,29.44 86.39,27.75 86.63,27.75 87.59,26.78 IC9.2 | C9.+ 66.12,30.64 66.12,36.68 C8.+ | v62.98,11.34 59.12,7.48 37.16,7.48 31.13,1.45 5.79,1.45 4.83,2.41 4.83,2.65 3.86,3.62 SV5.1 | C11.+ 66.12,17.61 66.12,11.58 C12.+
  Bottom 0.635: v70.46,40.78 69.98,40.78 66.12,36.92 C8.+ | v62.98,11.34 65.88,11.34 C12.+ | C11.+ 66.12,17.86 66.12,24.13 C10.+ 66.12,24.37 67.81,26.06 67.81,29.2 66.6,30.4 66.12,30.4 C9.+
N$24  (via drill 0.35)
  Top 0.635: VR2.2 58.64,36.68 60.81,34.51 VR2.3 | C13.1 45.85,20.51 48.98,20.51 50.19,21.72 54.53,21.72 55.74,20.51 R17.1 55.74,20.75 59.6,24.61 v59.6,25.58
  Bottom 0.635: v59.6,25.58 59.6,29.92 60.81,31.13 60.81,34.27 VR2.3
OUT
  Top 0.635: R4.2 95.07,7.72 92.66,7.72 90.25,10.13 C6.-
PSG1_CS
  Top 0.508: IC4.2 12.79,61.05 14.96,61.05 20.51,66.6 43.19,66.6 44.4,65.39 49.47,65.39 58.15,74.08 67.81,74.08 73.6,79.87 IC2.4
PSG1_LED  (via drill 0.35)
  Top 0.508: v92.42,90.49 90.97,90.49 84.45,97 45.61,97 35.47,86.87 35.47,82.53 31.85,78.91 31.85,76.25 IC1.5 | v97.48,52.6 97.48,4.58 94.59,1.69 78.18,1.69 76.25,3.62 LED1.A
  Bottom 0.508: v92.42,90.49 97.48,85.42 v97.48,52.6
PSG1_OUT  (via drill 0.35)
  Top 0.635: R7.2 76.25,39.33 81.08,39.33 R8.2 81.32,39.09 83.73,36.68 v83.73,16.41 | v8.93,32.33 8.93,49.71 12.55,53.33 IC4.5 | v83.73,10.62 v81.8,8.69
  Bottom 0.635: v8.93,32.33 30.89,10.38 30.89,8.45 34.02,5.31 42.23,5.31 45.12,2.41 72.87,2.41 79.15,8.69 v81.8,8.69 | v83.73,16.41 v83.73,10.62
PSG1_WR
  Bottom 0.508: IC4.1 12.55,63.7 6.76,69.49 6.76,72.39 20.03,85.66 27.51,85.66 36.92,95.07 78.91,95.07 85.18,88.8 85.18,86.63 84.45,85.9 84.45,80.83 81.32,77.7 IC2.12
PSG2_CS
  Top 0.508: IC5.2 33.06,61.05 38.37,61.05 39.57,62.26 44.16,62.26 46.33,64.43 49.71,64.43 58.4,73.11 69.25,73.11 73.6,77.46 IC2.5
PSG2_LED  (via drill 0.35)
  Top 0.508: v59.36,78.18 62.5,75.04 67.08,75.04 71.67,79.63 71.67,80.35 72.63,81.32 74.8,81.32 v78.18,77.94 | v71.42,6.51 v92.18,6.51
  Bottom 0.508: v59.36,78.18 36.2,78.18 35.47,77.46 35.47,77.22 34.51,76.25 IC1.6 | v78.18,77.94 78.18,67.32 85.66,59.84 85.66,38.37 90.25,33.78 90.25,28.23 93.14,25.34 93.14,14.24 94.11,13.27 94.11,8.45 v92.18,6.51 | v71.42,6.51 68.77,6.51 66.12,3.86 LED2.A
PSG2_OUT
  Top 0.635: R10.2 81.08,33.06 76.25,33.06 R9.2 76.25,33.3 69.01,40.54 63.46,40.54 62.5,39.57 53.09,39.57 49.47,43.19 43.19,43.19 41.74,41.74 39.33,41.74 38.61,42.47 38.61,48.5 33.78,53.33 33.06,53.33 IC5.5
PSG2_WR  (via drill 0.35)
  Top 0.508: v62.98,49.47 59.84,49.47 54.77,44.4 52.12,44.4 51.4,45.12 49.71,45.12 42.71,52.12 39.33,52.12 38.61,52.84 38.61,55.26 34.27,59.6 31.85,59.6 31.13,60.33 31.13,61.77 32.82,63.46 IC5.1 | v68.05,54.29 72.15,54.29 72.39,54.53 74.8,54.53 78.18,57.91 78.18,64.43 83.25,69.49 83.25,72.87 81.32,74.8 IC2.11
  Bottom 0.508: v62.98,49.47 65.15,49.47 68.05,52.36 v68.05,54.29
PSG3_CS  (via drill 0.35)
  Top 0.508: v63.7,66.6 63.7,61.29 62.01,59.6 59.84,59.6 58.64,60.81 53.57,60.81 IC6.2
  Bottom 0.508: v63.7,66.6 68.53,66.6 71.67,69.74 71.67,72.87 73.6,74.8 IC2.6
PSG3_LED
  Top 0.508: LED3.A 55.98,3.86 56.71,3.86 58.4,5.55 69.01,5.55 72.39,8.93 80.59,8.93 86.39,14.72 86.39,17.86 91.94,23.41 91.94,29.2 96.52,33.78 96.52,47.54 89.52,54.53 86.39,54.53 85.66,55.26 85.66,87.11 78.66,94.11 43.92,94.11 43.19,93.38 43.19,80.11 47.05,76.25 IC1.11
PSG3_OUT
  Top 0.635: R11.2 76.25,26.78 81.08,26.78 R12.2
  Bottom 0.635: IC6.5 53.57,53.33 58.15,48.74 58.15,42.47 68.53,32.09 70.7,32.09 76.01,26.78 R11.2
PSG3_WR
  Top 0.508: IC6.1 53.57,63.7 58.15,63.7 66.6,72.15 70.94,72.15 72.39,73.6 79.87,73.6 81.08,72.39 IC2.10
PSG_CLK  (via drill 0.35)
  Top 0.508: 20.39,37.28 27.27,44.16 27.27,45.36 30.16,48.26 IC5.7 | 20.39,37.28 19.3,36.2 19.3,33.78 12.79,27.27 12.79,26.78 QG1.8 | 20.39,37.28 v20.03,37.64
  Bottom 0.508: v20.03,37.64 15.44,42.23 15.44,42.95 13.99,44.4 11.58,44.4 10.62,45.36 10.62,46.33 12.55,48.26 IC4.7 | IC6.7 51.4,48.26 43.43,40.3 39.81,40.3 36.92,43.19 36.92,45.85 34.51,48.26 IC5.7
RCK  (via drill 0.35)
  Top 0.508: v79.15,59.12 79.15,63.94 v81.08,65.88 | v79.15,83.25 79.15,84.7 74.8,89.04 72.63,89.04 v71.18,87.59 | v67.08,89.76 67.08,91.21 v65.15,93.14 | v57.91,90.97 52.12,85.18 52.12,83.97 IC1.16
  Bottom 0.508: v79.15,59.12 79.15,52.84 81.08,50.91 IC3.12 | v81.08,65.88 81.08,67.56 79.15,69.49 v79.15,83.25 | v71.18,87.59 71.18,87.11 70.46,86.39 69.25,86.39 67.08,88.56 v67.08,89.76 | v65.15,93.14 60.08,93.14 v57.91,90.97
RST  (via drill 0.35)
  Top 0.508: v45.61,69.98 45.12,69.98 42.71,72.39 25.34,72.39 21.72,76.01 IC1.1 | v64.19,84.94 65.15,85.9 68.05,85.9 69.74,87.59 R1.2
  Bottom 0.508: v45.61,69.98 52.6,69.98 56.95,65.63 71.91,65.63 76.49,70.22 76.49,87.35 74.8,89.04 71.18,89.04 69.98,87.83 R1.2 | v64.19,84.94 65.88,83.25 65.88,82.77 SV1.5
SCK  (via drill 0.35)
  Top 0.508: v66.12,89.28 63.22,92.18 52.84,92.18 44.64,83.97 IC1.19 | v77.22,61.77 77.22,69.98 v75.53,71.67
  Bottom 0.508: v66.12,89.28 66.12,88.32 69.01,85.42 71.67,85.42 72.63,86.39 74.8,86.39 75.53,85.66 75.53,82.04 74.92,81.44 | 74.92,81.44 74.8,81.32 67.32,81.32 66.12,80.11 SV1.3 | v77.22,61.77 77.22,52.12 81.08,48.26 IC3.11 | v75.53,71.67 75.53,80.83 74.92,81.44
VBIAS
  Top 0.508: C7.1 90,49.47 87.83,47.3 87.83,44.64 R5.1 87.83,44.4 87.83,41.74 95.07,34.51 R6.2 95.07,34.27 90.97,30.16 90.97,27.27 87.83,24.13 IC9.3
VCC  (via drill 0.35)
  Top 0.889: C21.1 66.12,61.05 66.12,68.53 C20.1 | IC6.4 53.33,55.98 52.36,56.95 52.12,56.95 50.19,58.88 50.19,63.22 55.74,68.77 C18.1 | C22.1 87.83,16.65 87.83,17.61 93.14,22.92 93.14,27.27 95.07,29.2 IC9.8 | v50.43,18.58 53.57,18.58 55.02,17.13 v61.53,17.13 | IC3.10 81.32,45.61 82.28,44.64 82.53,44.64 87.59,39.57 87.59,34.51 R5.2 88.08,34.27 89.28,33.06 v91.45,33.06 | v28.47,44.88 35.95,37.4 35.95,36.2 34.02,34.27 30.89,34.27 26.06,29.44 25.58,29.44 C15.1 | R3.2 87.83,69.98 90.25,72.39 C3.1 90.49,72.63 90.49,80.59 93.87,83.97 94.11,83.97 95.07,84.94 IC8.8 | IC2.16 82.28,86.63 82.53,86.63 83.49,85.66 v83.49,78.18 | QG1.14 12.79,11.34 17.86,11.34 25.34,3.86 LED6.A | 10.38,58.4 10.38,63.94 15.2,68.77 C16.1 15.68,68.53 17.37,70.22 34.02,70.22 35.47,68.77 C17.1 | 10.38,58.4 10.38,57.91 11.34,56.95 11.58,56.95 12.55,55.98 IC4.4 | IC1.20 41.74,83.73 41.74,82.28 36.92,77.46 36.92,76.25 IC1.7 36.92,75.77 38.61,74.08 42.71,74.08 v45.61,71.18 | v9.89,58.4 10.38,58.4 | v62.74,90.97 59.6,87.83 R1.1
  Bottom 0.889: C20.1 65.88,68.53 61.29,68.53 59.84,67.08 57.43,67.08 55.98,68.53 C18.1 55.5,68.77 53.09,71.18 v45.61,71.18 | IC7.16 44.88,24.13 v50.43,18.58 | v61.53,17.13 64.43,17.13 65.39,16.17 81.8,16.17 84.45,18.82 84.45,31.13 87.59,34.27 R5.2 87.59,34.75 84.45,37.88 84.45,59.36 83.01,60.81 81.32,60.81 IC3.16 | v91.45,33.06 95.07,29.44 IC9.8 | C21.1 66.12,61.05 66.6,61.05 68.05,62.5 75.04,62.5 76.01,61.53 76.01,50.67 81.08,45.61 IC3.10 | IC5.4 32.82,55.98 28.47,51.64 v28.47,44.88 28.23,44.64 24.61,44.64 21.72,41.74 19.06,41.74 17.61,43.19 17.61,51.88 13.75,55.74 12.79,55.74 IC4.4 | v83.49,78.18 84.21,78.18 90,72.39 C3.1 | C19.1 21.48,89.04 20.03,89.04 13.99,95.07 C23.+ 13.51,95.31 11.1,97.73 8.2,97.73 6.51,96.04 6.51,95.31 SV3.2 6.27,94.83 6.27,83.25 4.58,81.56 4.58,63.7 v9.89,58.4 5.07,53.57 5.07,32.09 12.55,24.61 12.55,11.58 QG1.14 | 59.84,86.14 59.84,81.32 63.46,77.7 SV1.2 | 59.84,86.14 59.84,87.59 R1.1 | C17.1 35.71,68.77 35.71,75.04 36.68,76.01 IC1.7 | 59.84,86.14 43.92,86.14 41.74,83.97 IC1.20 | v62.74,90.97 74.56,90.97 77.7,87.83 81.08,87.83 IC2.16
WR_A  (via drill 0.35)
  Top 0.508: v64.67,92.18 63.7,93.14 v44.4,93.14
  Bottom 0.508: v64.67,92.18 79.39,92.18 83.25,88.32 83.25,87.11 82.53,86.39 80.11,86.39 79.15,85.42 79.15,84.7 81.08,82.77 IC2.14 | v44.4,93.14 37.4,93.14 29.44,85.18 29.44,83.97 IC1.25
WR_B
  Bottom 0.508: IC2.13 81.32,80.11 83.49,82.28 83.49,86.14 84.21,86.87 84.21,88.56 78.66,94.11 37.16,94.11 26.78,83.73 IC1.26
WR_E
  Top 0.635: IC1.15 54.77,83.97 61.53,83.97 64.43,86.87 67.08,86.87 70.22,90 76.25,90 81.08,85.18 IC2.15

### Text on the board
tPlace: HiT0M1 Ver2.80 | Ivory Aveline Haskell